# Altium schematic sheet DM3370_Power.SchDoc: =project_title (part 3 of 3)
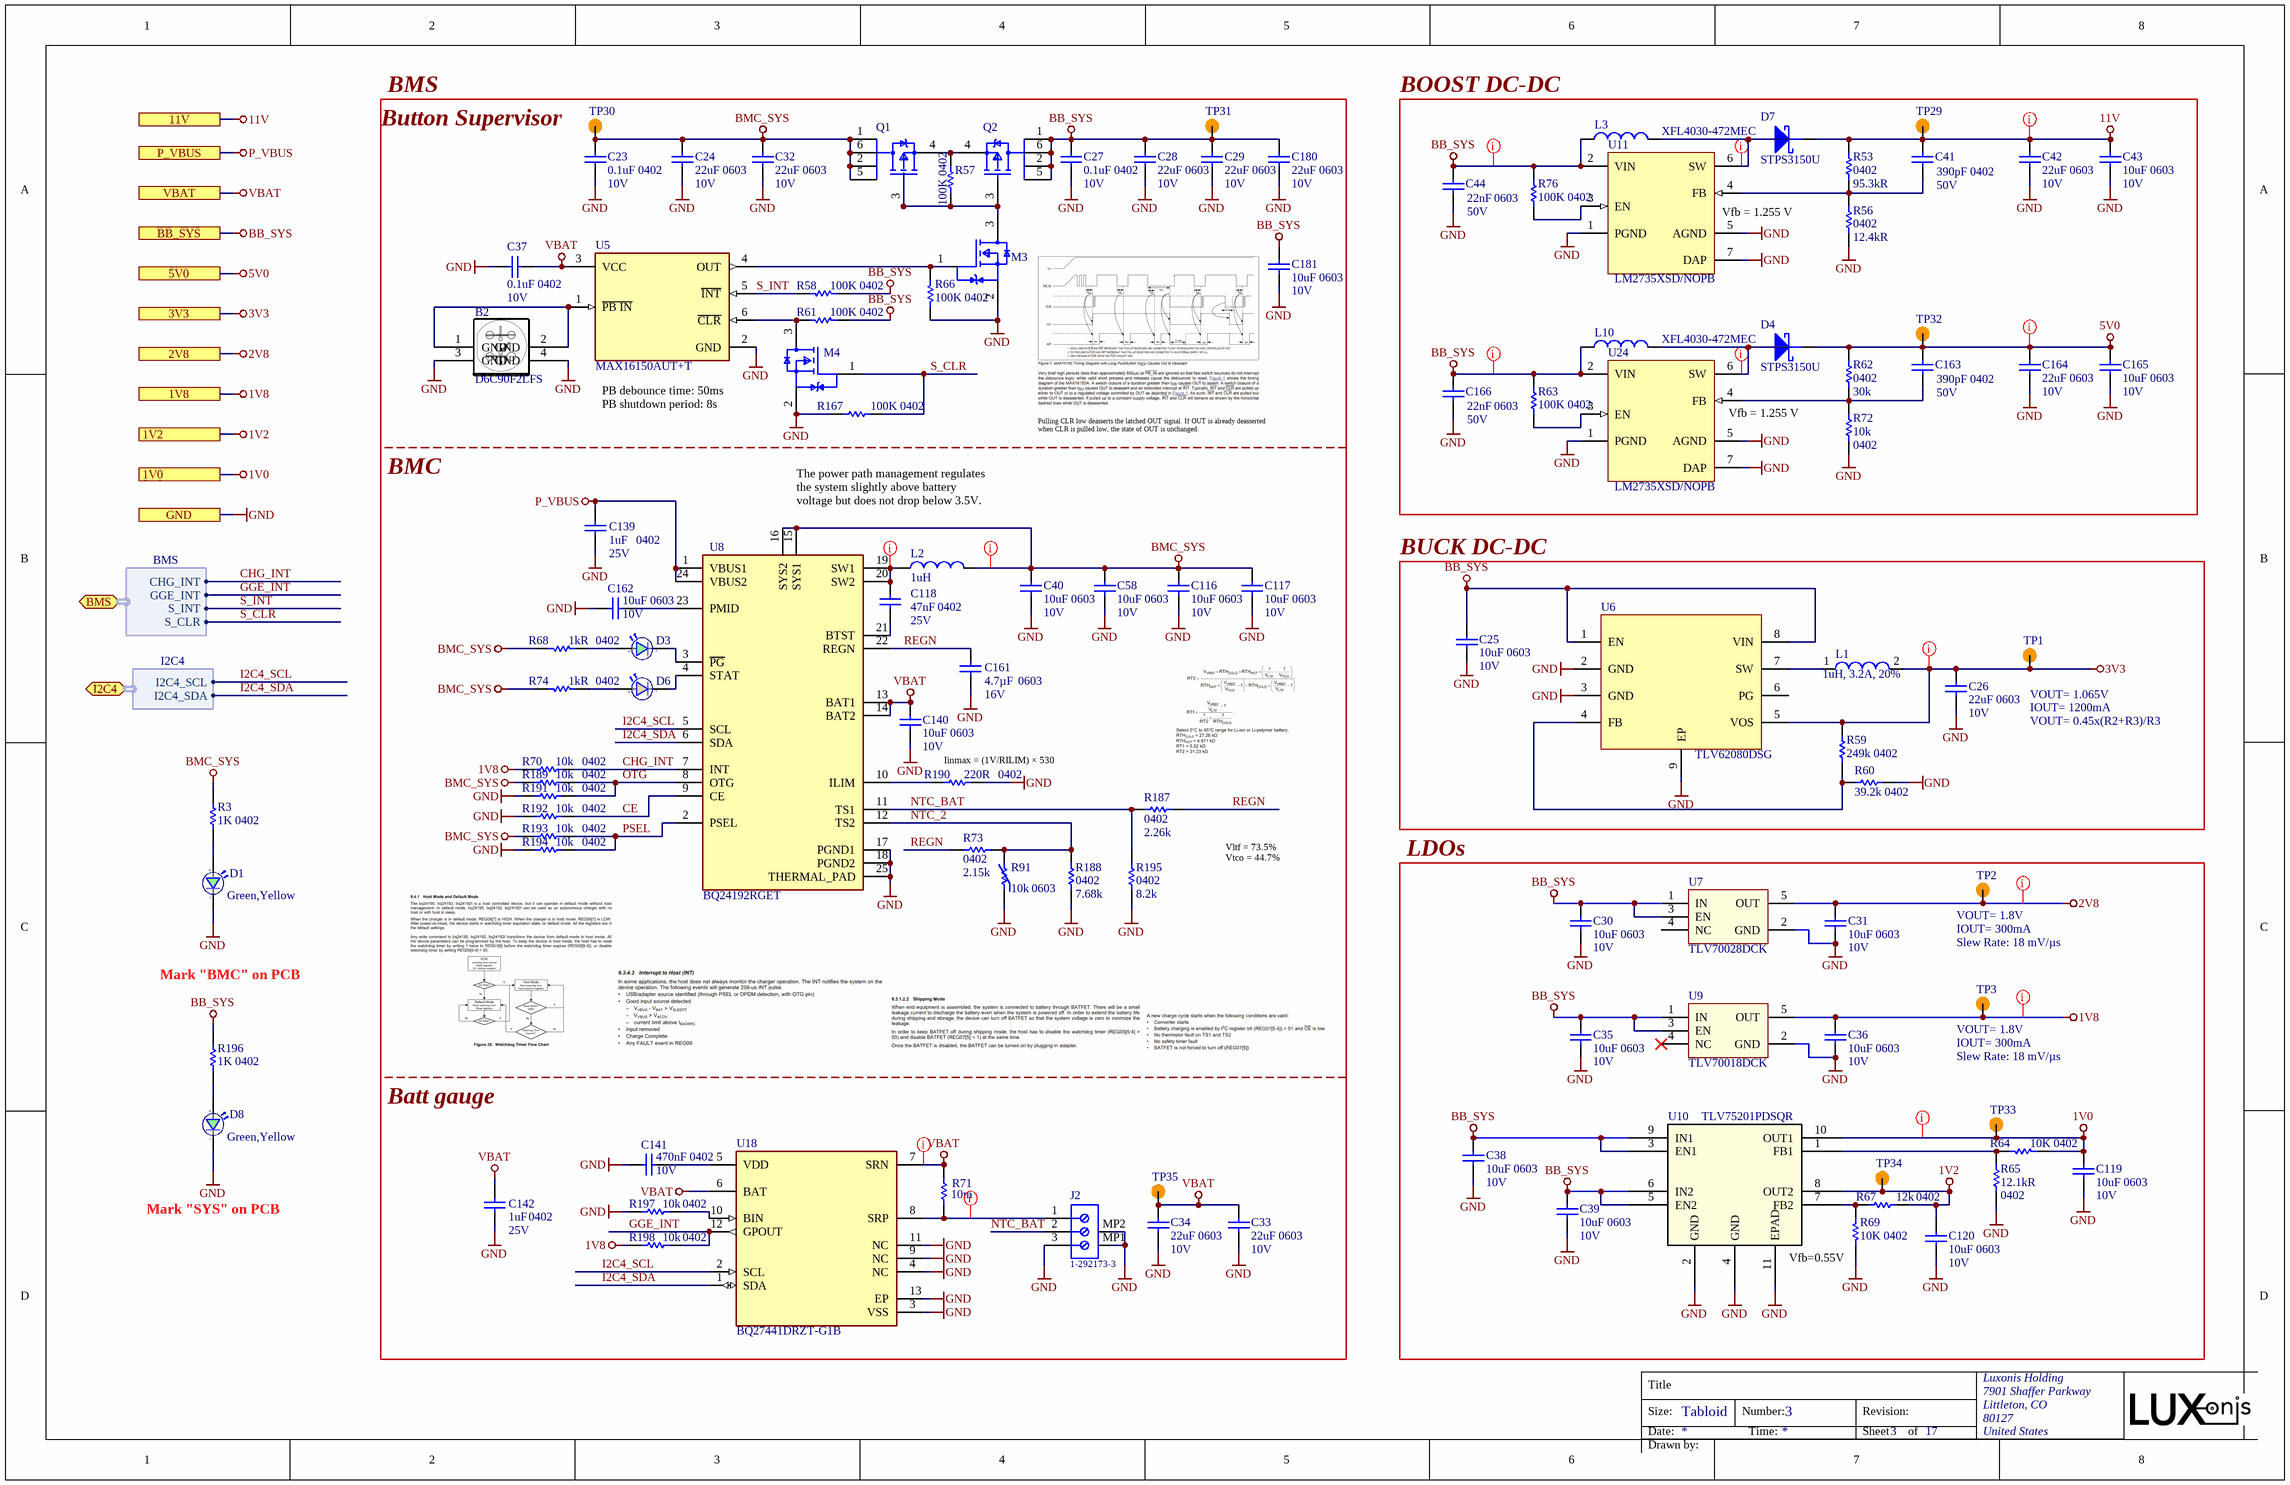
[diagram p2: DM3370_Power.SchDoc]

## Library data of the parts (continued)
R67 = CMP-013-000008-3: RES SMD 12K OHM 1% 1/16W 0402 12 kOhms ±1% 0.063W, 1/16W Chip Resistor 0402 (1005 Metric) Moisture Resistant Thick Film; Manufacturer 1: Yageo; Power Rating: 62.5mW; Max Power Dissipation: 63mW; Voltage Rating: 50V; Min Operating Temperature: -55°C; Case Code (Metric): 1005; Height: 0.016inch; Length: 1mm; Max Operating Temperature: 155°C; Design Item ID: RC0402FR-0712KL; Resistance: 12k; Manufacturer Part Number 1: RC0402FR-0712KL; Depth: 0.5mm; Case Code (Imperial): 0402; Tolerance: 1%
R68 R74 = CMP-013-000004-2: RES SMD 1K OHM 1% 1/16W 0402 1 kOhms ±1% 0.063W, 1/16W Chip Resistor 0402 (1005 Metric) Moisture Resistant Thick Film; Manufacturer 1: Yageo; Voltage Rating: 50V; Power Rating: 62.5mW; Max Operating Temperature: 155°C; Depth: 0.5mm; Design Item ID: RC0402FR-071KL; Manufacturer Part Number 1: RC0402FR-071KL; Number of Pins: 2; Case Code (Metric): 1005; Tolerance: 1%; Min Operating Temperature: -55°C; Length: 1mm; Height: 0.32mm; Case/Package: 0402
R70 R72 R189 R191-R194 R197 R198 = CMP-115-000004-6: RES SMD 10K OHM 1% 0402 1/16W Chip Resistor, 0402 [1005 Metric], 10 kohm, RC Series, 50 V, Thick Film, 62.5 mW; Manufacturer 1: Yageo; Power Rating: 62.5mW; Voltage Rating: 50V; Temperature Coefficient: 100ppm/°C; Design Item ID: RC0402FR-1310KL; Min Operating Temperature: -55°C; Manufacturer Part Number 1: RC0402FR-1310KL; Tolerance: 1%; Max Operating Temperature: 155°C
R71 = CMP-009-00190-5: RES SMD 0805 10mOhm 1% 1/4W; Manufacturer 1: Panasonic; Temperature Coefficient: 300ppm/°C; Power Rating: 500mW; Min Operating Temperature: -55°C; Tolerance: 1%; Max Operating Temperature: 155°C; Case/Package: 0805; Manufacturer Part Number 1: ERJ-6BWFR010V
R73 = CMP-009-00356-1: RES SMD 2.15k OHM 1% 1/16W; Manufacturer 1: Vishay / Dale; Power Rating: 62.5mW; Voltage Rating: 50V; Manufacturer Part Number 1: CRCW04022K15FKED; Tolerance: 1%
R91 = CMP-009-00234-1: NTC Thermistor, 10000ohm, Surface Mount; Manufacturer 1: Vishay; Tolerance: 1%; Voltage Rating: 75V; Min Operating Temperature: -40°C; RoHS Compliant: Yes; Max Operating Temperature: 125°C; Manufacturer Part Number 1: NTCG163JF103FT1
R187 = CMP-009-00357-1: RES SMD 2.26K OHM 1% 1/16W 0402; Manufacturer 1: Vishay / Dale; Voltage Rating: 50V; Power Rating: 62.5mW; Tolerance: 1%; Manufacturer Part Number 1: CRCW04022K26FKED
R188 = CMP-009-00355-1: RES SMD 7.68K OHM 1% 1/16W 0402; Manufacturer 1: Vishay / Dale; Power Rating: 62.5mW; Voltage Rating: 50V; Tolerance: 1%; Manufacturer Part Number 1: CRCW04027K68FKTD
R190 = CMP-013-000044-2: RES SMD 220 OHM 1% 1/16W 0402; Manufacturer 1: Yageo; Voltage Rating: 50V; Max Power Dissipation: 63mW; Power Rating: 62.5mW; Case Code (Metric): 1005; Tolerance: 1%; Depth: 0.5mm; Height: 0.016inch; Case/Package: 0402; Manufacturer Part Number 1: RC0402FR-07220RL; Length: 1mm; Max Operating Temperature: 155°C; Number of Pins: 2; Design Item ID: RC0402FR-07220RL; Min Operating Temperature: -55°C
R195 = CMP-009-00358-1: RES SMD 8.2K OHM 1% 1/16W 0402; Manufacturer 1: Bourns; Power Rating: 62.5mW; Voltage Rating: 50V; Tolerance: 1%; Manufacturer Part Number 1: CR0402-FX-8201GLF
TP1-TP3 TP29-TP35 = TEST_POINT
U5 = CMP-016-00011-1: Power Supply Support Circuit, Fixed, 1 Channel, PDSO6; Manufacturer 1: Maxim; Min Supply Voltage: 1.3V; Max Supply Voltage: 5.5V; Manufacturer part number 1: MAX16150AUT+T
U6 = TLV62080DSG: IC REG BUCK ADJ 1.2A SYNC 8WSON; Manufacturer 1: Texas Instruments; Manufacturer Part Number 1: TLV62080DSGR; Quiescent Current: 30uA; Switching Frequency: 2MHz; Output Voltage: 4V; Number of Outputs: 1; Min Input Voltage: 2.5V; Max Input Voltage: 5.5V; Min Output Voltage: 500mV; Synchronous Rectifier: Yes; Output Type: Adjustable; Output Configuration: Positive; Supplier 1: Digi-Key; Stock 1: 93781; Pricing 1: 1=1.35000, 10=1.20300, 100=0.93810, 500=0.77498, 1000=0.61182 (USD); RoHS: Yes; Mount: Surface Mount; Number of Pins: 8; Contact Plating: Gold; Min Operating Temperature: -40°C; Max Operating Temperature: 125°C; Output Current: 1.2A; Packaging: Tape and Reel; Package Quantity: 3000; Nominal Supply Current: 30uA; Min Supply Voltage: 2.5V; Max Output Current: 1.2A; Max Output Voltage: 4V; Lead Free: Lead Free; ComponentLink1URL: https://datasheet.ciiva.com/6604/tlv62080-6604087.pdf?src-supplier=Digi-Key; ComponentLink1Description: https://datasheet.ciiva.com/6604/tlv62080-6604087.pdf?src-supplier=Digi-Key; ComponentLink2URL: https://datasheet.ciiva.com/14378/tlv62080-14378282.pdf?src-supplier=Avnet; ComponentLink2Description: https://datasheet.ciiva.com/14378/tlv62080-14378282.pdf?src-supplier=Avnet; Supplier 2: Digi-Key; Manufacturer 2: Texas Instruments; Manufacturer Part Number 2: TLV62080DSGT; Stock 2: 6366; Pricing 2: 1=1.48000, 10=1.32700, 100=1.06620 (USD); Radiation Hardening: No; REACH SVHC: No SVHC; ComponentLink3URL: https://datasheet.ciiva.com/29732/tlv62080-29732147.pdf?src-supplier=Digi-Key; ComponentLink3Description: https://datasheet.ciiva.com/29732/tlv62080-29732147.pdf?src-supplier=Digi-Key; ComponentLink4URL: https://datasheet.ciiva.com/29732/tlv62080-29732156.pdf?src-supplier=Digi-Key; ComponentLink4Description: https://datasheet.ciiva.com/29732/tlv62080-29732156.pdf?src-supplier=Digi-Key; ComponentLink5URL: https://datasheet.ciiva.com/29732/tlv62080-29732151.pdf?src-supplier=Digi-Key; ComponentLink5Description: https://datasheet.ciiva.com/29732/tlv62080-29732151.pdf?src-supplier=Digi-Key; ComponentLink6URL: https://datasheet.ciiva.com/14378/tlv62080-14378283.pdf?src-supplier=Avnet; ComponentLink6Description: https://datasheet.ciiva.com/14378/tlv62080-14378283.pdf?src-supplier=Avnet; ComponentLink7URL: https://datasheet.ciiva.com/26104/tlv62080-26104460.pdf?src-supplier=Avnet+Europe; ComponentLink7Description: https://datasheet.ciiva.com/26104/tlv62080-26104460.pdf?src-supplier=Avnet+Europe; Supplier Part Number 1: 296-39270-1-ND; Supplier Part Number 2: 296-36759-1-ND
U7 = CMP-055-000001-2: IC REG LINEAR 2.8V 200MA SC70-5 Linear Voltage Regulator IC  1 Output  200mA SC-70-5; Manufacturer Part Number 1: TLV70028DCKT; Manufacturer 1: Texas Instruments; Quiescent Current: 30uA; Power Rating: 320mW; Output Type: Fixed; Polarity: Positive; Output Voltage Accuracy: 2%; Dropout Voltage: 175mV; Max Supply Voltage: 5.5V; Min Supply Voltage: 2V; Min Current Limit: 220mA; Number of Outputs: 1; Nominal Supply Current: 31uA; ComponentLink8Description: http://www.ti.com/general/docs/lit/getliterature.tsp?genericPartNumber=TLV700&&fileType=pdf&src-supplier=Avnet; Number of Pins: 5; Contact Plating: Gold; Source: DM9095_R3M2E4.SCHLIB; ComponentLink11Description: http://www.ti.com/lit/ds/slvsa00e/slvsa00e.pdf?src-supplier=Digi-Key; Nominal Output Voltage: 2.8V; Min Operating Temperature: -40°C; ComponentLink3URL: http://components.arrow.com/part/dataview/0323_00585634?src-supplier=Arrow+Europe; Power Dissipation: 320mW; Termination: SMD/SMT; ComponentLink10Description: http://www.ti.com/litv/slvsa00d?src-supplier=Mouser; RoHS: Yes; Max Power Dissipation: 320mW; Package Quantity: 1; Case/Package: SC; Radiation Hardening: No; ComponentLink9Description: http://components.arrow.com/part/dataview/48329233S8322732N7713?src-supplier=Arrow; Width: 1.4mm; ComponentLink6Description: http://www.ti.com/lit/pdf/slyy050?src-supplier=Digi-Key; Component Type: Standard; Stock 2: 30013; Packaging: Tape and Reel; Pricing 1: 1=0.55000, 10=0.46700, 100=0.34900 (USD); ComponentLink1URL: https://datasheet.ciiva.com/14149/tlv700-eng-ds-14149840.pdf?src-supplier=Distrelec; Pricing 2: 1=0.48000, 10=0.40900, 100=0.30570, 500=0.24020, 1000=0.18561 (USD); ComponentLink7Description: http://www.ti.com/general/docs/lit/getliterature.tsp?genericPartNumber=TLV700&&fileType=pdf&src-supplier=Avnet+Asia; Output Current: 200mA; ComponentLink3Description: http://components.arrow.com/part/dataview/0323_00585634?src-supplier=Arrow+Europe; ComponentLink1Description: https://datasheet.ciiva.com/14149/tlv700-eng-ds-14149840.pdf?src-supplier=Distrelec; Max Output Voltage: 2.8V; Min Output Voltage: 2.8V; Length: 2.15mm; ComponentLink6URL: http://www.ti.com/lit/pdf/slyy050?src-supplier=Digi-Key; ComponentLink9URL: http://components.arrow.com/part/dataview/48329233S8322732N7713?src-supplier=Arrow; REACH SVHC: No SVHC; ComponentLink7URL: http://www.ti.com/general/docs/lit/getliterature.tsp?genericPartNumber=TLV700&&fileType=pdf&src-supplier=Avnet+Asia; Accuracy: 2%; Stock 1: 832; ComponentLink5Description: http://www.ti.com/lit/ds/slvsa00d/slvsa00d.pdf?src-supplier=Digi-Key; Max Operating Temperature: 125°C; Max Input Voltage: 5.5V; Manufacturer Part Number 2: TLV70028DCKR; Pin Count: 5; ComponentLink11URL: http://www.ti.com/lit/ds/slvsa00e/slvsa00e.pdf?src-supplier=Digi-Key; Design Item ID: TLV70028DCK; Min Input Voltage: 2V; ComponentLink4URL: http://focus.ti.com/lit/ds/symlink/tlv70033.pdf?src-supplier=Avnet+Europe; Lead Free: Lead Free; ComponentLink2URL: https://datasheet.ciiva.com/22700/1882059-22700172.pdf?src-supplier=Element14; Height: 1mm; ComponentLink5URL: http://www.ti.com/lit/ds/slvsa00d/slvsa00d.pdf?src-supplier=Digi-Key; ComponentLink4Description: http://focus.ti.com/lit/ds/symlink/tlv70033.pdf?src-supplier=Avnet+Europe; Output Voltage: 2.8V; ComponentLink10URL: http://www.ti.com/litv/slvsa00d?src-supplier=Mouser; Max Output Current: 200mA; ComponentLink8URL: http://www.ti.com/general/docs/lit/getliterature.tsp?genericPartNumber=TLV700&&fileType=pdf&src-supplier=Avnet; ComponentLink2Description: https://datasheet.ciiva.com/22700/1882059-22700172.pdf?src-supplier=Element14; Manufacturer 2: Texas Instruments; Number of Regulators: 1
U8 = CMP-019-00058-1: Power Supply Management Circuit, Fixed, 1 Channel, +18V, PQCC24; Manufacturer part number 1: BQ24192RGER; Manufacturer 1: TI
U9 = TLV70018DCK: IC REG LINEAR 1.8V 200MA SC70-5 Linear Voltage Regulator IC  1 Output  200mA SC-70-5; Manufacturer 1: Texas Instruments; Manufacturer Part Number 1: TLV70018DCKR; Max Power Dissipation: 320mW; Number of Outputs: 1; Dropout Voltage: 175mV; Max Input Voltage: 5.5V; Min Input Voltage: 2V; Min Current Limit: 220mA; Polarity: Positive; Output Voltage Accuracy: 2%; Quiescent Current: 30uA; Output Type: Fixed; Nominal Supply Current: 31uA; Supplier 1: Digi-Key; Stock 1: 63905; Pricing 1: 1=0.48000, 10=0.40900, 100=0.30570, 500=0.24020, 1000=0.18561 (USD); RoHS: Yes; Case/Package: SC; Number of Pins: 5; Contact Plating: Gold; Min Operating Temperature: -40°C; Max Operating Temperature: 125°C; Packaging: Tape and Reel; Package Quantity: 1; Output Voltage: 1.8V; Output Current: 200mA; Max Output Current: 200mA; Number of Regulators: 1; Power Dissipation: 320mW; Nominal Output Voltage: 1.8V; Accuracy: 2%; Max Output Voltage: 1.8V; Min Output Voltage: 1.8V; REACH SVHC: No SVHC; Lead Free: Lead Free; ComponentLink1URL: https://datasheet.ciiva.com/41462/001014631-da-01-en-ic-reg-ldo-1-8v-0-tlv70018dckr-sot-5-tid-41462480.pdf?src-supplier=Conrad; ComponentLink1Description: https://datasheet.ciiva.com/41462/001014631-da-01-en-ic-reg-ldo-1-8v-0-tlv70018dckr-sot-5-tid-41462480.pdf?src-supplier=Conrad; Supplier 2: Digi-Key; Manufacturer 2: Texas Instruments; Manufacturer Part Number 2: TLV70018DCKT; Stock 2: 13188; Pricing 2: 1=0.55000, 10=0.46700, 100=0.34900 (USD); Power Rating: 320mW; Length: 2.15mm; Height: 1mm; Width: 1.4mm; Radiation Hardening: No; ComponentLink2URL: https://datasheet.ciiva.com/22700/1882059-22700171.pdf?src-supplier=Element14; ComponentLink2Description: https://datasheet.ciiva.com/22700/1882059-22700171.pdf?src-supplier=Element14; ComponentLink3URL: https://datasheet.ciiva.com/14149/tlv700-eng-ds-14149837.pdf?src-supplier=Distrelec; ComponentLink3Description: https://datasheet.ciiva.com/14149/tlv700-eng-ds-14149837.pdf?src-supplier=Distrelec; ComponentLink4URL: https://datasheet.ciiva.com/7992/1882059-7992894.pdf?src-supplier=Element14; ComponentLink4Description: https://datasheet.ciiva.com/7992/1882059-7992894.pdf?src-supplier=Element14; Supplier Part Number 1: 296-32409-1-ND; Supplier Part Number 2: 296-25269-1-ND
U10 = CMP-045-000003-2: TLV752 Dual, 1-A, High-Accuracy, Adjustable-LDO in a Small-Size Package; Manufacturer 1: Texas Instruments; Design Item ID: TLV75201PDSQR; RefDes: RefDes; Copyright: Copyright (C) 2021 Ultra Librarian. All rights reserved.; Manufacturer Part Number 1: TLV75201PDSQR; Source: DM1099.SCHLIB; Type: DEV
U11 U24 = CMP-043-000004-2: 520kHz/1.6MHz space efficient boost and SEPIC DC-DC regulator 6-WSON -40 to 125; Manufacturer 1: TI; Output Configuration: Positive; Max Output Voltage: 24V; Output Current: 2.1A; Max Output Current: 3A; Efficiency: 90%; Synchronous Rectifier: No; Output Type: Adjustable; Min Supply Voltage: 2.7V; Number of Outputs: 1; Operating Supply Voltage: 5.5V; Quiescent Current: 7mA; Min Output Voltage: 3V; Switching Frequency: 1.6MHz; Topology: Boost,Flyback,SEPIC; Nominal Supply Current: 500uA; Number of Pins: 6; Lead Free: Lead Free; Packaging: Tape and Reel; Manufacturer Part Number 1: LM2735XSD/NOPB; Radiation Hardening: No; Series: -; Max Input Voltage: 5.5V; Min Operating Temperature: -40°C; Mount: Surface Mount; Output Voltage: 24V; Max Operating Temperature: 125°C; Min Input Voltage: 2.7V; Package Quantity: 1000; RoHS Compliant: Yes; Contact Plating: Tin
U18 = CMP-019-00056-4: Power Supply Management Circuit, Fixed, 1 Channel, PDSO12; Manufacturer 1: TI; Manufacturer part number 1: BQ27441DRZT-G1B